# EAGLE board GNUBLIN_1_6 (EAGLE 6.4)
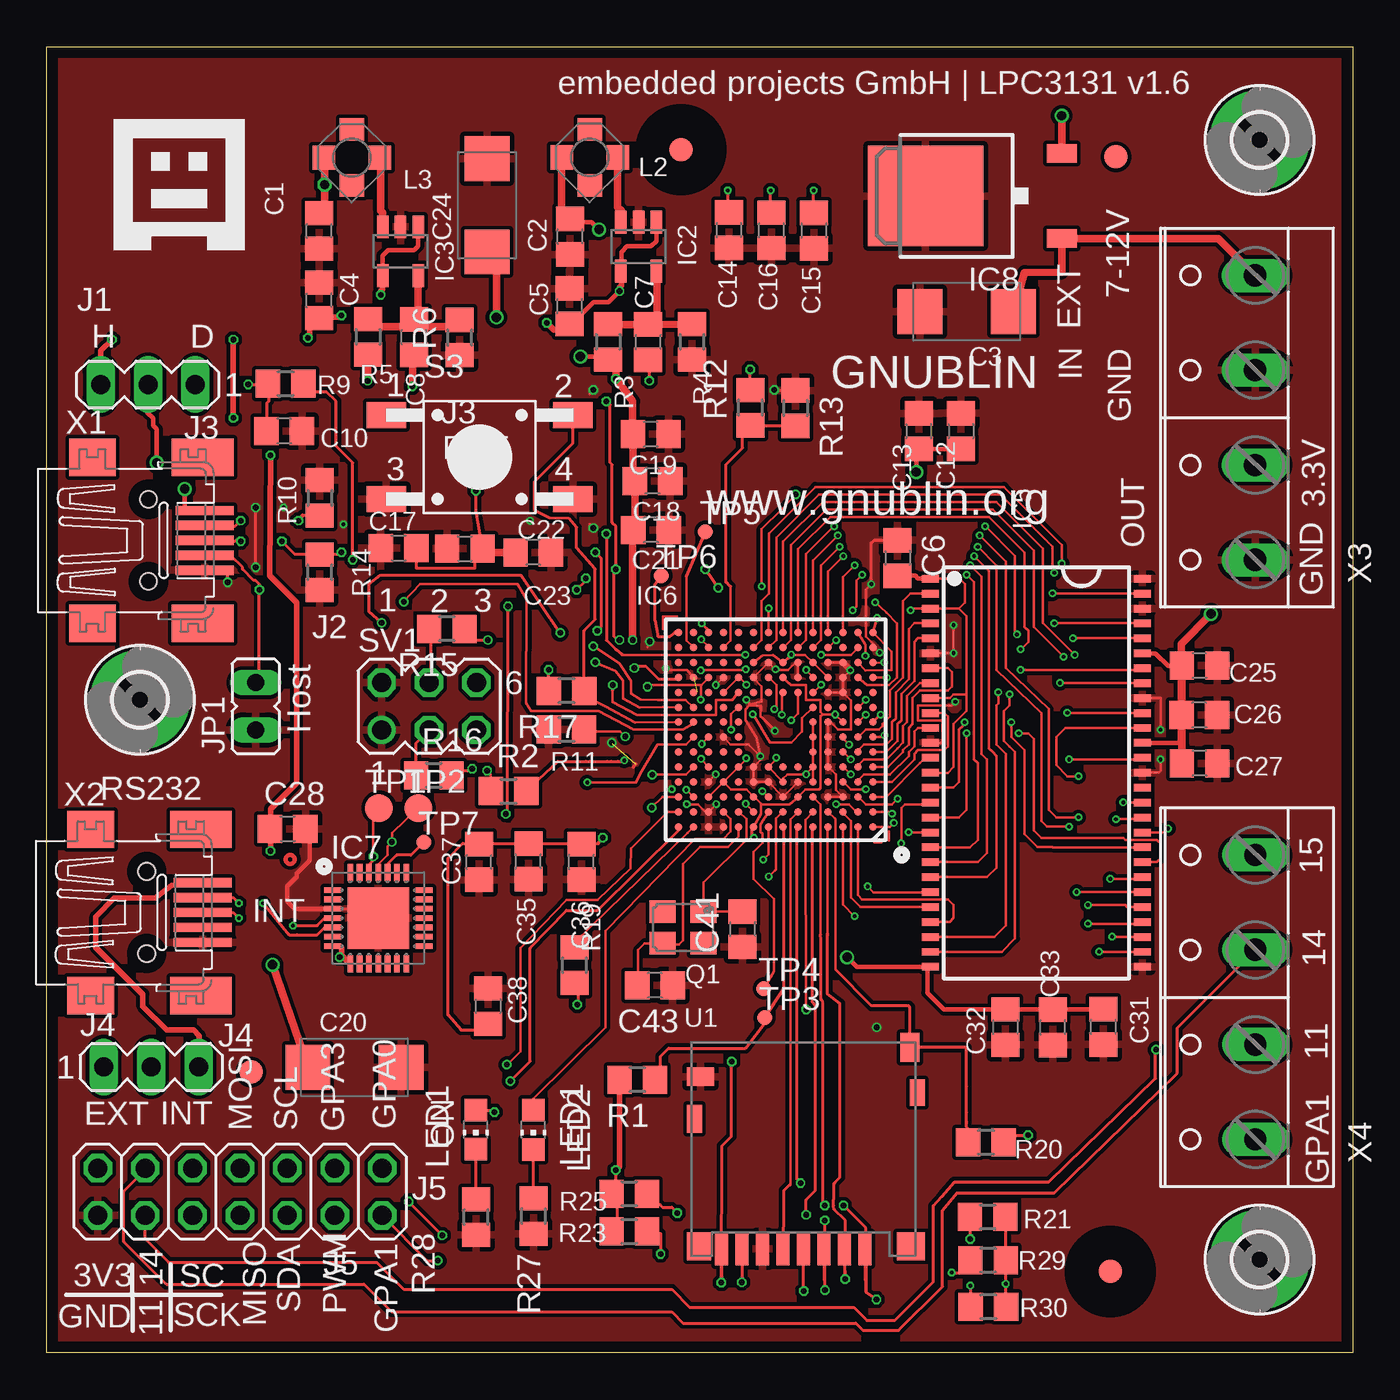
[diagram p2: board, top side]
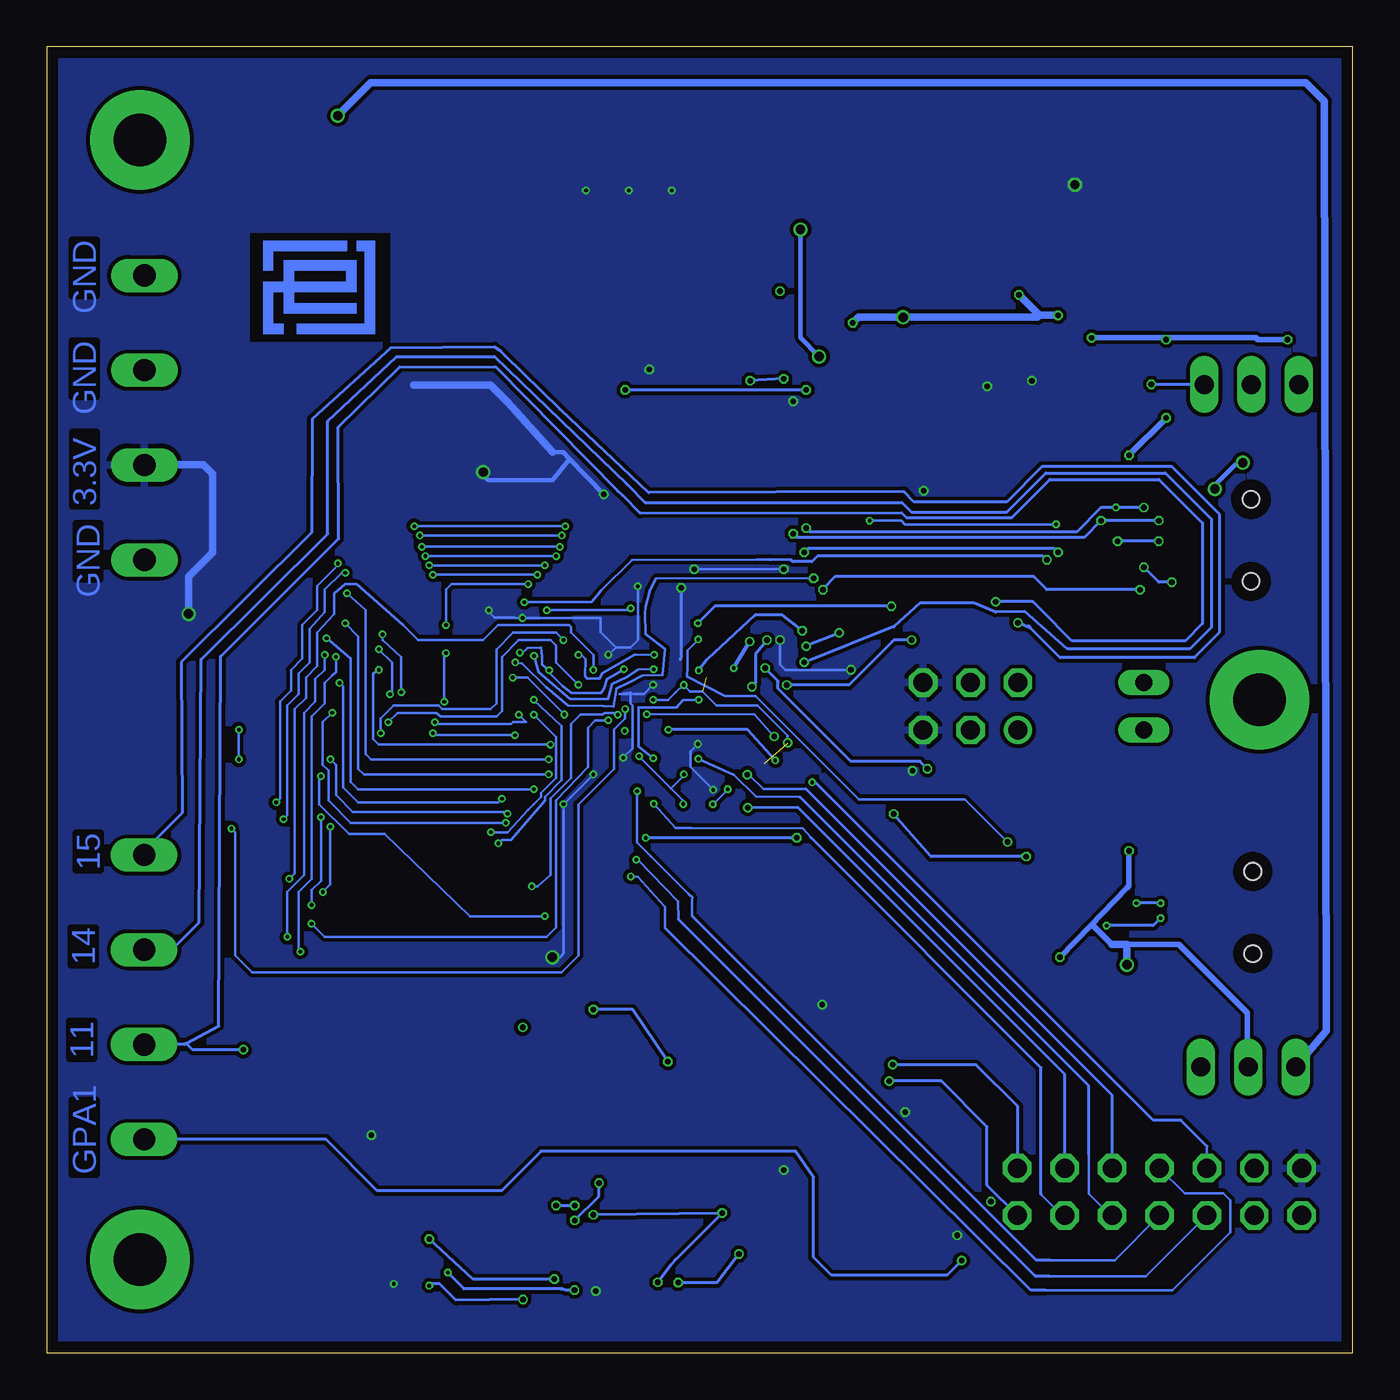
[diagram p3: board, bottom side, seen from below]

Size 70 x 70 mm. Coordinates in mm from the lower left corner, seen from the top.
Outline: 0,70 70,70 70,0 0,0 0,70
Copper layers (1*16): Top 0.035mm / dielectric 0.1mm / Bottom 0.035mm
Design rules "default *": minimum track width 0.12mm, minimum drill 0.2mm, track to track 0.025mm, track to pad 0.1mm, pad to pad 0.1mm, via to via 0.1mm, smd to smd 0mil, copper to edge 0.6mm, drill to drill 8mil, minimum pad ring 6mil, minimum via ring 4mil, stop-mask expansion 2mil, vias tented up to drill 20mil, thermal gap 10mil
Net classes: 0 default: width 0.2 mm, drill 0.3 mm, clearance 0.2 mm; 1 500mA: width 0.3 mm, drill 0.3 mm, clearance 0.15 mm
bRestrict: area 51.6,54.2 to 59.1,60

## Footprints (pad centres in the part's own frame; a part is rotated, then mirrored left to right if it is on the bottom)
C0805 = smd 1.3 x 1.5: 1 -0.95,0; 2 0.95,0
SMC_C = smd 2.4 x 2.4: + -2.5,0; - 2.5,0
PASSERMARKEN_FIDUCIAL = smd 1.27 x 1.27: 1 0,0
2,8-PAD = drill 2.8 pad 5.334: B2,8 0,0
TSOT23 = smd 0.622 x 1.22: 1 -0.95,-1.31; 2 0,-1.31; 3 0.95,-1.31; 4 0.95,1.31; 5 -0.95,1.31
TSOPII = smd 0.4 x 0.9: 1 1.03,0.67; 2 1.83,0.67; 3 2.63,0.67; 4 3.43,0.67; 5 4.23,0.67; 6 5.03,0.67; 7 5.83,0.67; 8 6.63,0.67; 9 7.43,0.67; 10 8.23,0.67; 11 9.03,0.67; 12 9.83,0.67; 13 10.63,0.67; 14 11.43,0.67; 15 12.23,0.67; 16 13.03,0.67; 17 13.83,0.67; 18 14.63,0.67; 19 15.43,0.67; 20 16.23,0.67; 21 17.03,0.67; 22 17.83,0.67; 23 18.63,0.67; 24 19.43,0.67; 25 20.23,0.67; 26 21.03,0.67; 27 21.83,0.67; 28 21.83,12.03; 29 21.03,12.03; 30 20.23,12.03; 31 19.43,12.03; 32 18.63,12.03; 33 17.83,12.03; 34 17.03,12.03; 35 16.23,12.03; 36 15.43,12.03; 37 14.63,12.03; 38 13.83,12.03; 39 13.03,12.03; 40 12.23,12.03; 41 11.43,12.03; 42 10.63,12.03; 43 9.83,12.03; 44 9.03,12.03; 45 8.23,12.03; 46 7.43,12.03; 47 6.63,12.03; 48 5.83,12.03; 49 5.03,12.03; 50 4.23,12.03; 51 3.43,12.03; 52 2.63,12.03; 53 1.83,12.03; 54 1.03,12.03
TFBGA180 = smd 0.4 x 0.4: A1 -5.2,5.2; A2 -4.4,5.2; A3 -3.6,5.2; A4 -2.8,5.2; A5 -2,5.2; A6 -1.2,5.2; A7 -0.4,5.2; A8 0.4,5.2; A9 1.2,5.2; A10 2,5.2; A11 2.8,5.2; A12 3.6,5.2; A13 4.4,5.2; A14 5.2,5.2; B1 -5.2,4.4; B2 -4.4,4.4; B3 -3.6,4.4; B4 -2.8,4.4; B5 -2,4.4; B6 -1.2,4.4; B7 -0.4,4.4; B8 0.4,4.4; B9 1.2,4.4; B10 2,4.4; B11 2.8,4.4; B12 3.6,4.4; B13 4.4,4.4; B14 5.2,4.4; C1 -5.2,3.6; C2 -4.4,3.6; C3 -3.6,3.6; C4 -2.8,3.6; C5 -2,3.6; C6 -1.2,3.6; C7 -0.4,3.6; C8 0.4,3.6; C9 1.2,3.6; C10 2,3.6; C11 2.8,3.6; C12 3.6,3.6; C13 4.4,3.6; C14 5.2,3.6; D1 -5.2,2.8; D2 -4.4,2.8; D3 -3.6,2.8; D4 -2.8,2.8; D5 -2,2.8; D6 -1.2,2.8; D7 -0.4,2.8; D8 0.4,2.8; D9 1.2,2.8; D10 2,2.8; D11 2.8,2.8; D12 3.6,2.8; D13 4.4,2.8; D14 5.2,2.8; E1 -5.2,2; E2 -4.4,2; E3 -3.6,2; E4 -2.8,2; E5 -2,2; E6 -1.2,2; E7 -0.4,2; E8 0.4,2; E9 1.2,2; E10 2,2; E11 2.8,2; E12 3.6,2; E13 4.4,2; E14 5.2,2; F1 -5.2,1.2; F2 -4.4,1.2; F3 -3.6,1.2; F4 -2.8,1.2; F5 -2,1.2; F10 2,1.2; F11 2.8,1.2; F12 3.6,1.2; F13 4.4,1.2; F14 5.2,1.2; G1 -5.2,0.4; G2 -4.4,0.4; G3 -3.6,0.4; G4 -2.8,0.4; G5 -2,0.4; G10 2,0.4; G11 2.8,0.4; G12 3.6,0.4; G13 4.4,0.4; G14 5.2,0.4; H1 -5.2,-0.4; H2 -4.4,-0.4; H3 -3.6,-0.4; H4 -2.8,-0.4; H5 -2,-0.4; H10 2,-0.4; H11 2.8,-0.4; H12 3.6,-0.4; H13 4.4,-0.4; H14 5.2,-0.4; J1 -5.2,-1.2; J2 -4.4,-1.2; J3 -3.6,-1.2; J4 -2.8,-1.2; J5 -2,-1.2; J10 2,-1.2; J11 2.8,-1.2; J12 3.6,-1.2; J13 4.4,-1.2; J14 5.2,-1.2; K1 -5.2,-2; K2 -4.4,-2; K3 -3.6,-2; K4 -2.8,-2; K5 -2,-2; K6 -1.2,-2; K7 -0.4,-2; K8 0.4,-2; K9 1.2,-2; K10 2,-2; K11 2.8,-2; K12 3.6,-2; K13 4.4,-2; K14 5.2,-2; L1 -5.2,-2.8; L2 -4.4,-2.8; L3 -3.6,-2.8; L4 -2.8,-2.8; L5 -2,-2.8; L6 -1.2,-2.8; L7 -0.4,-2.8; L8 0.4,-2.8; L9 1.2,-2.8; L10 2,-2.8; L11 2.8,-2.8; L12 3.6,-2.8; L13 4.4,-2.8; L14 5.2,-2.8; M1 -5.2,-3.6; M2 -4.4,-3.6; M3 -3.6,-3.6; M4 -2.8,-3.6; M5 -2,-3.6; M6 -1.2,-3.6; M7 -0.4,-3.6; M8 0.4,-3.6; M9 1.2,-3.6; M10 2,-3.6; M11 2.8,-3.6; M12 3.6,-3.6; M13 4.4,-3.6; M14 5.2,-3.6; N1 -5.2,-4.4; N2 -4.4,-4.4; N3 -3.6,-4.4; N4 -2.8,-4.4; N5 -2,-4.4; N6 -1.2,-4.4; N7 -0.4,-4.4; N8 0.4,-4.4; N9 1.2,-4.4; N10 2,-4.4; N11 2.8,-4.4; N12 3.6,-4.4; N13 4.4,-4.4; N14 5.2,-4.4; P1 -5.2,-5.2; P2 -4.4,-5.2; P3 -3.6,-5.2; P4 -2.8,-5.2; P5 -2,-5.2; P6 -1.2,-5.2; P7 -0.4,-5.2; P8 0.4,-5.2; P9 1.2,-5.2; P10 2,-5.2; P11 2.8,-5.2; P12 3.6,-5.2; P13 4.4,-5.2; P14 5.2,-5.2
MLP28 = smd 0.9 x 0.3: 1 -2.45,1.5; 2 -2.45,1; 3 -2.45,0.5; 4 -2.45,0; 5 -2.45,-0.5; 6 -2.45,-1; 7 -2.45,-1.5; 15 2.45,-1.5; 16 2.45,-1; 17 2.45,-0.5; 18 2.45,0; 19 2.45,0.5; 20 2.45,1; 21 2.45,1.5 | smd 0.3 x 0.9: 8 -1.5,-2.45; 9 -1,-2.45; 10 -0.5,-2.45; 11 0,-2.45; 12 0.5,-2.45; 13 1,-2.45; 14 1.5,-2.45; 22 1.5,2.45; 23 1,2.45; 24 0.5,2.45; 25 0,2.45; 26 -0.5,2.45; 27 -1,2.45; 28 -1.5,2.45 | smd 3.3 x 3.3: EXP 0,0
DPACK_3 = smd 1 x 1.6: 1 -2.28,-4.8; 3 2.28,-4.8 | smd 5.4 x 6.2: 4 0,2.5
MA03-1 = drill 1.016 long: 1 -2.54,0; 2 0,0; 3 2.54,0
2X07 = drill 1.016 octagon: 1 -7.62,-1.27; 2 -7.62,1.27; 3 -5.08,-1.27; 4 -5.08,1.27; 5 -2.54,-1.27; 6 -2.54,1.27; 7 0,-1.27; 8 0,1.27; 9 2.54,-1.27; 10 2.54,1.27; 11 5.08,-1.27; 12 5.08,1.27; 13 7.62,-1.27; 14 7.62,1.27
JP1 = drill 0.914 long: 1 0,-1.27; 2 0,1.27
PSU3014 = smd 1.2 x 1.3: 1 -1.5,0; 2 1.5,0 | smd 1.3 x 1.2: 3 0,1.5; 4 0,-1.5
CHIP-LED0805 = smd 1.2 x 1.2: A 0,-1.05; C 0,1.05
SX-32 = smd 1.4 x 1.2: 1 -1.1,-0.85; 2 1.1,-0.85; 3 1.1,0.85; 4 -1.1,0.85
R0805 = smd 1.3 x 1.5: 1 -0.95,0; 2 0.95,0
TASTER-9314_SMD = smd 2.1 x 1.4: 1 -5,2.25; 2 5,2.25; 3 -5,-2.25; 4 5,-2.25
MA03-2 = drill 1.016: 1 -2.54,-1.27 | drill 1.016 octagon: 2 -2.54,1.27; 3 0,-1.27; 4 0,1.27; 5 2.54,-1.27; 6 2.54,1.27
TP15R = smd 1.5 x 1.5: TP 0,0
TP08R = smd 0.8 x 0.8: TP 0,0
DM3D-SF = smd 0.7 x 1.75: 1 7.7,-0.875; 2 6.6,-0.875; 3 5.5,-0.875; 4 4.4,-0.875; 5 3.3,-0.875; 6 2.2,-0.875; 7 1.1,-0.875; 8 0,-0.875 | smd 1.3 x 1.5: P$1 -1.2,-0.75 | smd 1.5 x 1.5: P$10 10.15,-0.75 | smd 0.8 x 1.4: P$11 10.5,7.5 | smd 0.8 x 1.5: P$13 -1.45,6.1 | smd 1 x 1.55: SW_A 10.1,9.925 | smd 1.45 x 1: SW_B -1.125,8.35
32005-201 = smd 3.1 x 0.5: 1 3,1.6; 2 3,0.8; 3 3,0; 4 3,-0.8; 5 3,-1.6 | smd 2.5 x 2: M1 -3,-4.45; M2 -3,4.45 | smd 3.3 x 2: M3 2.9,4.45; M4 2.9,-4.45 | hole 0.9: 0,2.2; 0,-2.2
W237-4P = drill 1.194 long: 1 -7.62,-0.635; 2 -2.54,-0.635; 3 2.54,-0.635; 4 7.62,-0.635

## Placement (x,y rotation side)
C1  10uF  [C0805]  14.6,60.12 90 top
C2  10uF  [C0805]  28.05,59.81 90 top
C3  10uF  [SMC_C]  49.3,55.8 180 top
C4  4.7uF  [C0805]  14.6,56.4 90 top
C5  4.7uF  [C0805]  28.03,56.09 90 top
C6  100nF  [C0805]  45.6,42.6 270 top
C7  22pF  [C0805]  32.24,54.17 90 top
C8  22pF  [C0805]  19.69,54.43 90 top
C10  100nF  [C0805]  12.73,49.4 180 top
C12  3.3nF  [C0805]  49,49.4 270 top
C13  10uF  [C0805]  46.73,49.39 270 top
C14  10uF  [C0805]  36.58,60.16 90 top
C15  3.3nF  [C0805]  41.13,60.14 90 top
C16  100nF  [C0805]  38.85,60.15 90 top
C17  3.3nF  [C0805]  18.86,43.13 0 top
C18  100nF  [C0805]  32.47,46.72 180 top
C19  3.3nF  [C0805]  32.38,49.23 180 top
C20  [SMC_C]  16.5,15.3 0 top
C21  10uF  [C0805]  32.39,44.1 180 top
C22  100nF  [C0805]  22.41,43.09 0 top
C23  10uF  [C0805]  26.07,42.9 180 top
C24  10uF  [SMC_C]  23.6,61.5 90 top
C25  3.3nF  [C0805]  61.79,36.83 180 top
C26  100nF  [C0805]  61.78,34.19 180 top
C27  10uF  [C0805]  61.78,31.6 180 top
C28  2.2uF  [C0805]  12.92,28.08 0 top
C31  3.3nF  [C0805]  56.63,17.47 90 top
C32  10uF  [C0805]  51.39,17.46 90 top
C33  100nF  [C0805]  53.92,17.44 90 top
C35  100nF  [C0805]  25.82,26.33 90 top
C36  3.3nF  [C0805]  28.66,26.31 90 top
C37  10uF  [C0805]  23.17,26.3 90 top
C38  100nF  [C0805]  23.66,18.58 270 top
C41  22pF  [C0805]  37.3,22.7 90 top
C43  22pF  [C0805]  32.6,19.7 180 top
FID1  [PASSERMARKEN_FIDUCIAL]  34,64.48 0 top
FID2  [PASSERMARKEN_FIDUCIAL]  57,4.36 0 top
FID3  [PASSERMARKEN_FIDUCIAL]  10.95,15.05 0 top
FID4  [PASSERMARKEN_FIDUCIAL]  57.3,64.1 0 top
H1  MOUNT-PAD-ROUND2.8  [2,8-PAD]  65,5 0 top
H2  MOUNT-PAD-ROUND2.8  [2,8-PAD]  5,35 0 top
H4  MOUNT-PAD-ROUND2.8  [2,8-PAD]  65,65 0 top
IC2  AS1324  [TSOT23]  31.72,59.28 180 top
IC3  AS1324  [TSOT23]  18.96,59.03 180 top
IC5  A43E26161TSOPII  [TSOPII]  46.69,42.52 270 top
IC6  LPC313XFET180  [TFBGA180]  39.07,33.4 180 top
IC7  CP21021  [MLP28]  17.77,23.3 0 top
IC8  MC78M05ABDT  [DPACK_3]  49.6,62 90 top
J3  [MA03-1]  5.43,51.89 180 top
J4  [MA03-1]  5.6,15.32 0 top
J5  [2X07]  10.36,8.63 180 top
JP1  [JP1]  11.2,34.65 0 top
L2  4u7  [PSU3014]  29.1,64.06 180 top
L3  4u7  [PSU3014]  16.35,64.05 180 top
LED1  GRUEN  [CHIP-LED0805]  23,11.96 180 top
LED2  ROT  [CHIP-LED0805]  26.08,11.95 180 top
Q1  SX-32 12.000 MHz  [SX-32]  34.1,22.8 180 top
R1  10K  [R0805]  31.65,14.64 180 top
R2  10K  [R0805]  24.75,30.1 0 top
R3  301K  [R0805]  30.09,54.17 270 top
R4  301K  [R0805]  34.59,54.17 90 top
R5  301K  [R0805]  17.23,54.45 270 top
R6  66K5  [R0805]  22.14,54.41 90 top
R9  10K  [R0805]  12.81,51.94 0 top
R10  1M  [R0805]  14.64,45.82 270 top
R11  12K 1%  [R0805]  27.85,33.41 0 top
R12  10K  [R0805]  37.72,50.65 90 top
R13  DNP  [R0805]  40.13,50.63 270 top
R14  1M  [R0805]  14.64,41.83 90 top
R15  10K  [R0805]  21.45,38.8 180 top
R16  10K  [R0805]  20.75,30.95 0 top
R17  10K  [R0805]  27.87,35.48 180 top
R19  10K  [R0805]  28.29,20.77 90 top
R20  10K  [R0805]  50.33,11.28 180 top
R21  10K  [R0805]  50.42,7.28 180 top
R23  10K  [R0805]  31.22,6.51 0 top
R25  10K  [R0805]  31.22,8.53 0 top
R27  270R  [R0805]  26.09,7.33 90 top
R28  270R  [R0805]  23.01,7.28 90 top
R29  10K  [R0805]  50.46,4.96 180 top
R30  10K  [R0805]  50.46,2.47 180 top
S3  [TASTER-9314_SMD]  23.2,48 0 top
SV1  [MA03-2]  20.49,34.65 0 top
TP1  TPTP15R  [TP15R]  17.81,29.2 0 top
TP2  TPTP15R  [TP15R]  19.91,29.2 0 top
TP3  PTR1TP08R  [TP08R]  38.47,17.96 0 top
TP4  PTR1TP08R  [TP08R]  38.44,19.52 0 top
TP5  TPTP08R  [TP08R]  35.3,44 0 top
TP6  TPTP08R  [TP08R]  32.95,41.65 0 top
TP7  TPTP08R  [TP08R]  20.21,27.36 0 top
U1  DM3D-SF  [DM3D-SF]  36.16,6.45 0 top
U$3  GNUBLINLOGOSIEB  [GNUSIEBDRUCK]  3.6,59.1 0 top
U$4  EPLOGO  [EPLOGOKUPFER]  58.4,54.6 0 bottom
X1  MINI-USB-32005-201  [32005-201]  5.46,43.54 0 top
X2  MINI-USB-32005-201  [32005-201]  5.36,23.6 0 top
X3  [W237-4P]  64.13,50.12 90 top
X4  [W237-4P]  64.14,19.06 90 top

## Tracks (layer width: path | path; a pad name or v marks a point on that pad's centre or on a via)
5V  (via drill 0.3, 0.5)
  Top 0.254: C5.1 28.14,55.14 29.3,56.3 30.1,56.3 v30.7,56.9 | IC3.1 19.91,59.31 19.7,59.1 18.3,59.1 18,58.8 18,57.74 IC3.4 | IC2.1 32.67,59.57 32.4,59.3 31.1,59.3 30.8,59 30.8,58 IC2.4
  Top 0.3: 15.8,21.3 16.2,20.9 IC7.8 | 15.8,21.3 15.8,21.7 15.7,21.8 15.4,21.8 IC7.7 | v12,26.9 12,28 C28.1 12,28.2 12,29.15 13.4,30.55 13.4,40.2 11.95,41.65 v12,48.1 | v15.7,21.2 15.8,21.3 | v30.7,56.9 30.7,57.1 30.8,57.2 30.8,57.9 30.8,58 IC2.4 | v26.8,55.2 27.2,54.8 28,54.8 C5.1 | v17.9,56.7 17.9,56.9 18,57 18,57.7 IC3.4 | v15.8,55.6 15.7,55.5 14.7,55.5 C4.1 14.5,55.5 14.1,55.5 14.1,54.5 v14,54.4 | v3.5,54.3 2.9,53.7 J3.3 | v10,50.1 v10,54.3
  Top 0.406: v12.1,20.8 C20.+ | C24.+ 24.1,59 v24.1,55.5
  Bottom 0.3: v12,26.9 12,25.02 12.1,24.92 14.08,22.88 v15.7,21.2 | v3.5,54.3 5.1,54.3 5.2,54.4 10.2,54.4 | 10.2,54.4 v14,54.4 | 26.7,55.3 v26.8,55.2 | 16.8,55.6 16.9,55.5 | v12,48.1 v10,50.1 | v10,54.3 10.2,54.4
  Bottom 0.305: J4.2 5.65,15.37 5.65,18.21 9.33,21.89 12.91,21.89 13.9,22.88 14.08,22.88
  Bottom 0.406: v17.9,56.7 16.8,55.6 v15.8,55.6 | 26.7,55.3 26.5,55.5 v24.1,55.5 | 16.9,55.5 23.6,55.5 | 23.6,55.5 v24.1,55.5 | 12.91,21.89 12.1,21.89 v12.1,20.8 | 23.6,55.5 v24.1,55.5
+1V2  (via drill 0.2, 0.3, 0.5)
  Top 0.125: IC6.D11 IC6.C12 | IC6.D11 IC6.E10 37.48,31.8 v37.49,31.86 | IC6.D11 36.68,30.19 37.51,30.19 37.87,29.83 IC6.C9 37.92,29.8 38.3,29.42 38.28,29.36 | 38.28,29.36 38.28,28.88 IC6.A9 | 38.28,29.36 38.29,29.4 39.81,29.4 40.27,29.77 IC6.C6 40.67,30.19 41.41,30.19 41.48,30.27 41.48,34.12 41.59,34.2 | 41.59,34.2 42.09,34.2 | 42.09,34.2 v42.26,34.21 | v42.26,34.21 IC6.H3 | IC6.L1 44.92,36.2 v45.03,36.19 | 42.09,34.2 v42.26,34.21 | IC6.L7 39.53,36.2 39.47,36.16 39.67,35.99 39.9,35.79 40.7,35.79 40.7,35 41.46,35 41.46,34.35 41.59,34.2 | v35.06,35 35.06,35.75 35.09,35.79 | 35.09,35.79 35.49,36.2 IC6.L12 35.47,36.17 35.09,35.79 | 35.09,35.79 32.21,35.79
  Top 0.15: C38.2 23.6,17.3 22.2,17.3 21.5,18.1 21.5,26.5 22.3,27.3 23.1,27.3 C37.2 23.2,27.3 25.8,27.3 C35.2 25.9,27.3 28.6,27.3 C36.2 28.7,27.3 29.6,27.3 29.6,27.4 v29.8,27.6 | v37.9,27.6 37.8,27.7 37.8,28.1 IC6.A9 | 27.6,60.6 28,60.6 C2.2 | 27.6,64 L2.2 | 31.4,49.2 C19.2 31.4,49.3 31.4,49.7 | 31.4,44.1 C21.2 31.4,44 | 31.5,46.1 31.5,46.7 C18.2 | 30.5,53.2 30.1,53.2 R3.2 | v32.3,52.1 32.3,53.1 32.1,53.2 C7.1 | 32.21,35.79 v32.2,35.7 | 32.21,35.79 32.2,35.8 32.21,35.79
  Top 0.254: 28,60.6 29.2,60.6 v29.6,60.2 | v28.6,53.4 29.92,53.4 R3.2
  Top 0.406: 27.6,60.6 27.6,64 | 30.5,53.2 v30.5,52.2 31.4,51 31.4,49.7 | v31.4,38.2 31.4,44 | C21.2 31.52,44.17 C18.2 | 31.5,46.7 31.43,46.77 C19.2
  Bottom 0.125: v45.03,36.19 44.24,36.19 v42.26,34.21 | v35.06,35 35.8,34.99 35.9,34.99 36.24,34.59 38.27,34.58 38.27,32.5 v37.49,31.86
  Bottom 0.15: v29.8,27.6 v37.9,27.6 | v30.5,52.2 v32.3,52.1 | v32.2,35.7 32,35.9 32,36.1 | 32,36.1 32,36.2 32,36.1 | 32,36.1 32,37.5 v31.4,38.2
  Bottom 0.254: v29.6,60.2 29.6,54.4 v28.6,53.4
+3V3  (via drill 0.2, 0.3, 0.5)
  Top 0.125: IC6.M2 43.87,36.58 45.26,36.6 45.27,37.58 IC6.P1 v44.5,39.38 | IC6.L10 36.99,36.17 | IC6.C13 v34.28,30.17 | v37.5,35.81 37.11,36.22 IC6.L10 | IC6.G12 v35.1,32.63 | R2.1 23.8,31 v23.6,31.2 | IC6.H5 IC6.G5 IC6.F5 IC6.E5 | IC6.L4 IC6.M5 40.64,37.39 39.94,37.39 IC6.M7 | IC6.M7 v39.9,37.42 | v38.32,41.08 38.32,44.14 39.43,45.25 v40.14,46 | 60.83,32.13 60.78,36.06 60.81,36.38 C25.2 60.81,36.8 | IC6.M9 38.35,37.38 38.93,37.39 IC6.M7 | 36.28,35.4 IC6.K11 36.28,35.4 | IC6.B2 43.41,29 43,29.4 v42.3,29.4 | IC6.E5 IC6.D5 | IC6.E5 40.7,31.02 v40.7,31 39.7,31 39.47,30.77 IC6.D7 IC6.E8 39.1,31.82 v39.1,31.9 | IC5.27 47.2,20.65 | v46.3,39.8 46.39,39.89 IC5.3 47.38,39.9 48.9,39.9 | 60.75,32.69 60.83,32.6 | 49.29,35.29 49.3,34.99 | 49.29,35.29 49.3,34.99 | 49.29,35.29 48.59,35.29 48.4,35.1 IC5.9 | 49.29,35.29 49.3,35.4 49.3,39.5 48.9,39.9 | IC5.14 48.29,31.09 48.6,31.4 48.6,33.7 49.3,34.4 49.3,34.99 | 36.28,35.4 36.3,35.4 | IC5.1 48.91,41.49 49.2,41.2 49.2,40.2 48.9,39.9 | IC5.43 60.79,32.69 60.8,32.7 | IC6.L10 36.28,35.4
  Top 0.15: R30.1 51.4,2.5 v51.4,3.7 51.4,4.9 R29.1 51.4,5 51.4,7.2 R21.1 | R23.1 30.6,6.5 30.6,8.5 R25.1 30.5,8.7 v30.5,9.8 | v14.9,62.6 14.9,64.1 L3.2 14.9,64 | 14.9,61.1 14.7,61.1 C1.2 | v28.44,18.66 28.52,19.95 R19.1 | v26.9,36.6 26.9,35.5 R17.2 | v52.59,11.66 51.26,11.65 R20.1 | 17.2,53.1 R5.2 | 19.6,53.1 C8.1 | v37.7,52.7 37.7,51.6 R12.2 | v36.5,62.3 36.5,61.3 C14.2 | v38.8,62.3 38.8,61.3 C16.2 | v41.1,62.3 41.1,61.1 C15.2 | v40.58,3.32 40.57,3.56 U1.4 | v23,46.2 23,45.1 C22.2 22.95,43.09 22.95,42.05 19.81,42.05 C17.2 | v30,51 30.2,50.8 30.2,47.7 30.3,47.6 30.3,44.5 30.5,44.3 v30.5,42 30.4,41.9 30.4,38.4 30.6,38.2 v30.7,38.2 | v35.3,42 v36,41 | v24,12.9 23.9,13 23.1,13 23,13.1 LED1.A | v21.2,6.3 v19.4,8.1 | C32.2 | 53.9,18.4 C33.2 54,18.4 | 56.6,18.4 C31.2
  Top 0.254: C32.2 53.9,18.4 | 54,18.4 56.6,18.4 | C32.2 48.09,18.41 47.2,19.3 47.2,20.65 | IC5.27 43.61,20.69 43.41,20.69 v42.9,21.2 | IC5.49 59.41,37.49 60.1,36.8 60.81,36.8 | IC5.43 60.75,32.69 | C6.2 46.55,41.65 46.7,41.5 IC5.1 | v46.6,47.2 46.6,47.81 C13.2 48.89,48.44 C12.2
  Top 0.305: R1.2 30.7,10 v30.5,9.8
  Top 0.406: 14.9,61.1 14.9,64 | v17.2,52.1 17.2,53.1 | v19.6,51.8 19.6,53.1 | C22.2 23.36,42.9 C23.2 | C27.2 60.83,32.6 C26.2 60.83,36.64 60.78,36.64 60.78,36.83 C25.2 | 60.8,32.7 60.8,38 v62.4,39.6
  Bottom 0.125: v34.28,30.17 34.26,30.2 34.3,30.2 35.5,31.4 35.5,32.23 v35.1,32.63 35.1,32.58 | v39.9,37.42 39.5,37.8 | 39.5,37.8 38.7,37.8 38.3,38.2 v38.32,41.08 | v40.7,31 41.9,29.8 42.2,29.5 v42.3,29.4 42.3,21.4 42.5,21.2 v42.9,21.2 | v46.3,39.8 46.3,39.7 46,39.4 44.92,39.4 v44.5,39.38 40.33,39.39 40.33,38.63 39.5,37.8 | v39.1,31.9 38.6,32.4 38.6,34.7 38.7,34.8 38.7,35.4 39.3,35.3 38,35.3 v37.5,35.81 | v30.5,42 v35.3,42 | v26.9,36.6 30.4,36.6 30.7,36.9 v30.7,38.2
  Bottom 0.15: v36,41 36,37.3 36.05,37.15 | 42.88,48.27 42.89,48.33
  Bottom 0.254: v40.14,46 41.97,47.9 | 41.97,47.9 42.9,46.77 46.35,46.77 46.57,46.97 v46.6,47.2 | 42.88,48.27 42.34,48.27 41.97,47.9
  Bottom 0.406: 42.88,48.27 45.31,50.96 46.21,51.86 50.34,51.86 | v62.4,39.6 62.4,41.6 61.1,42.9 61.1,47.1 61.6,47.6 64.75,47.6 X3.2
  pour Bottom: -2.23,72.83 73.51,72.83 73.51,-5.33 -2.22,-5.33 -2.22,72.82
EXT_5V  (via drill 0.5)
  Top 0.406: v54.4,66.3 IC8.3
  Bottom 0.406: J4.1 1.43,17.25 1.53,67.07 2.53,68.07 52.02,68.07 52.63,68.07 v54.4,66.3
GND  (via drill 0.2, 0.3)  (2 unrouted)
  Top 0.125: IC6.D6 39.57,29.89 39.5,29.89 39.47,29.86 IC6.C7 IC6.D8 IC6.D9 IC6.E9 38.25,31.77 v38.25,31.97 | IC6.E4 | IC6.G11 36.27,32.97 36.64,32.6 37.62,32.6 v38.25,31.97 | v35.89,29.41 IC6.B12 35.3,29 34.9,29.4 v34.3,29.4 | IC6.D12 35.47,30.62 v35.85,31 | IC6.N1 v44.64,37.53 44.64,37.46 44.3,37.8 44.3,38 43.9,38.4 43.9,40.9 v44.2,41.2 | 43.07,36.6 v43.07,36.58 42.67,36.18 IC6.K3 | IC6.L13 34.31,36.59 33.4,36.59 33.26,36.7 v33.18,36.7 | v32.33,38.12 32.34,38.09 32.21,37.83 | 38.27,34.67 38.25,34.63 38.25,34.15 39.03,33.37 v39.03,33.33 38.25,34.11 38.27,34.67 | 38.27,34.67 38.07,34.69 37.65,34.69 37.45,34.47 37.45,33.92 38.05,32.99 v38.25,31.97 | IC6.L11 v35.87,35.79 v35.86,35.79 | v30.29,32.69 30.29,32.66 | v25.9,44.6 26,44.6 | IC6.C4 IC6.C3 42.3,30.17 42.3,31 41.91,31.39 IC6.E4 | IC6.E4 IC6.F4 IC6.G4 IC6.H4 42.01,33.8 42.4,33.4 43.1,33.4 43.1,34.97 IC6.K3 | IC6.K3 IC6.L3 | IC6.K3 IC6.K4 | IC6.M3 IC6.M4 | IC6.L6 IC6.M6 40.12,36.99 39.73,36.6 39.1,36.6 39.07,36.6 IC6.M8 IC6.L9 37.87,36.17 38.3,35.7 38.3,34.9 37.7,34.74 | IC5.12 47.89,32.69 48,32.8 48,33.9 46.7,33.9 46.7,34.7 48.5,34.7 v48.7,34.9 | IC5.6 47.38,37.5 v48.6,37.5 v48.6,39 | IC5.46 59.69,35.09 59.7,35.1 v59.7,33.4 | v59.7,31.8 59.7,31.2 59.6,31.1 58.74,31.1 IC5.41 | v37.5,35 37.7,34.74 | 37.7,34.74 38.27,34.67
  Top 0.15: 15.3,23.8 IC7.3 15.4,23.8 16.7,23.8 16.7,23.4 16.8,23.3 17.7,23.3 IC7.EXP | v39.06,36.63 39.1,36.6 39.07,36.6 | v39,51.6 40.1,51.6 R13.1 | v29.3,51.6 29.1,51.4 | v29.3,44.2 29.1,44.4 | v11.2,42.1 v11.2,45.3 | v9.7,41.3 9.7,41.8 9.6,41.9 8.5,41.9 | C6.1 44.35,43.55 44.2,43.4 v44.2,41.2
  Top 0.2: 31.56,31.55 31.55,31.55 31.44,31.39
  Top 0.254: IC7.3 13.3,23.8 12.9,24.2 12.9,25 13.4,25.5 13.4,25.7 14.1,26.4 14.1,27.85 C28.2
  Top 0.305: 43.07,36.6 IC6.M3
  Bottom 0.125: v35.89,29.41 35.89,29.61 36.53,30.25 | v38.25,31.97 36.53,30.25 | v35.85,31 35.85,30.93 36.53,30.25 | v44.64,37.53 44.59,37.43 44.23,37.78 43.5,37.8 43.46,37.31 43.46,36.9 v43.07,36.58 43.07,36.45 42.35,35.75 41.87,35.36 40.29,35.37 40.13,35.59 39.98,36.12 v39.06,36.63 | v30.29,32.69 30.29,33.08 31.91,34.7 32.15,34.7 34.1,34.7 34.85,35.45 35.52,35.45 v35.86,35.79 36.3,35.4 36.7,35 v37.5,35 | v34.3,29.4 v33.5,30.2 | v15.9,44.4 18.2,44.4 18.3,44.4 24,44.4 24.2,44.6 v25.9,44.6 | v48.7,34.9 48.7,37.4 v48.6,37.5 | v59.7,31.8 v59.7,33.4 | v44.2,41.2 48.3,41.2 48.6,40.9 v48.6,39
  Bottom 0.15: v29.3,51.6 v39,51.6 | v29.3,44.2 29.1,44 14.8,44 13.5,45.3 v12.7,45.3 v11.2,45.3 | v11.2,42.1 10.4,41.3 v9.7,41.3
  Bottom 0.254: v32.33,38.12 v33.18,36.7
  other vias: 44.49,17.44
  pour Top: 0.75,73.53 74.92,73.53 74.92,-6.08 -3.55,-6.08 -3.55,73.54
GPA0  (via drill 0.3)
  Top 0.125: IC6.B14 33.28,29 31.33,27.04 31.3,25.96 29.51,24.27 27.87,24.27 25.39,21.69 25.39,16.16 v24.67,15.44
  Bottom 0.15: v24.67,15.44 20.19,15.44 17.96,13.21 17.96,9.92 J5.1
GPA1  (via drill 0.3)
  Top 0.15: IC6.A14 33.87,28 29.51,23.71 27.86,23.71 25.91,21.69 25.91,15.63 v24.85,14.57 | v20.97,4.94 20.4,4.94 J5.2
  Bottom 0.15: v24.85,14.57 22.05,14.57 19.6,12.12 19.6,8.98 J5.2 | X4.1 55.03,11.44 52.28,8.69 45.62,8.69 43.51,10.8 29.87,10.8 28.9,9.41 28.9,5.12 27.94,4.16 21.75,4.16 v20.97,4.94
GPA3  (via drill 0.3)
  Top 0.125: IC6.C14 32.99,29.8 v32.42,29.22
  Bottom 0.125: 29.75,29.24 v32.42,29.22
  Bottom 0.15: 29.75,29.24 15.44,14.93 J5.3
GPIO0  (via drill 0.3)
  Top 0.125: IC6.K10 37.07,35.44 36.75,34.99 35.88,34.99 35.87,34.19 33.02,34.19 31.65,34.18 30.33,34.87 30.32,35.49
  Top 0.15: v30.34,35.79 30.32,35.49 | v23.65,38.2 22.55,38.2 R15.1
  Bottom 0.125: 24.6,38.2 24.68,38.12
  Bottom 0.15: v30.34,35.79 27,35.8 24.68,38.12 | 24.6,38.2 24.68,38.12 | 24.6,38.2 24.68,38.12 | v23.65,38.2 24.6,38.2
GPIO2  (via drill 0.3)
  Top 0.15: v31.5,36.7 31.6,36.8 32.1,36.8 32.8,36.1 33.8,36.1 IC6.L14 | v22.8,31.3 22.7,31.2 22.5,31.2 22.2,31.2 21.8,31.6 21.7,31.6 21.7,31 R16.2
  Bottom 0.15: v31.5,36.7 30.8,36 30.8,35.6 26.9,31.7 23.2,31.7 v22.8,31.3
GPIO11  (via drill 0.3)
  Top 0.125: 34.67,33.74 34.1,33.4 31.45,33.4 29.58,34.4 25.96,34.4 25.69,34.83 25.73,40.38 25.23,41.21 20.01,41.21 v19.14,40.26
  Top 0.15: 34.67,33.74 IC6.H13 | J5.12 5.28,6.11 6.54,4.85 17.69,4.85 19.14,3.4 33.5,3.4 34.46,2.44 43.25,2.44 43.95,1.74 45.45,1.74 47.51,3.8 47.51,7.88 47.98,8.38 48.65,9.16 53.7,9.16 59.42,14.7 59.42,16.2 v59.46,16.24
  Bottom 0.15: X4.2 62.62,16.52 62.52,16.58 | 62.52,16.58 60.78,17.51 60.68,37.33 54.34,43.63 54.37,49.61 51.08,52.83 45.95,52.84 39.39,46.17 39.14,45.96 38.2,45.01 24.18,45.02 23.92,44.76 18.28,44.76 16.24,46.8 10.39,46.8 8.06,44.47 8.06,39.08 8.98,38.16 15.05,38.16 16.73,39.84 17.15,40.26 v19.14,40.26 | v59.46,16.24 62.18,16.24 62.52,16.58
GPIO14  (via drill 0.3)
  Top 0.125: IC6.J14 33.01,34.6 31.76,34.59 30.89,35.06 30.88,36.03 30.48,36.55 v29.4,37
  Top 0.15: J5.11 5.28,9.8 4.13,8.65 4.13,5.96 6.41,3.68 17,3.68 18.49,2.19 33.5,2.19 34.1,1.59 43.36,1.59 43.75,1.2 45.66,1.2 48.01,3.55 48.01,7.64 48.77,8.57 54,8.57 60.59,14.99 60.59,17.41 X4.3
  Bottom 0.15: X4.3 63.31,21.6 61.83,23.08 61.72,37.16 54.94,43.88 54.94,49.93 51.24,53.4 46,53.4 38.91,46.55 38.88,46.53 37.92,45.57 24.17,45.57 23.66,45.06 18.55,45.06 16.46,47.15 10.05,47.15 7.58,44.68 7.58,38.88 8.74,37.72 15.29,37.72 17.58,39.73 19.15,39.7 20.31,40.19 23.21,40.18 24.59,38.92 v29.4,37
GPIO15  (via drill 0.3)
  Top 0.125: IC6.J13 34.24,35 32.76,35 31.82,35.01 31.31,35.34 31.31,36 30.69,36.94 v29.3,37.87
  Top 0.15: v27.52,38.58 25.42,41.67 17.9,41.67 17.29,41.19 17.27,40.96 17.28,39.72 v17.95,39.13
  Bottom 0.15: 64.78,26.91 62.74,28.94 62.78,37.01 55.81,43.95 55.77,50.05 51.58,53.85 46,53.9 45.7,53.71 45.44,53.44 42.49,50.57 42.42,50.51 37.74,46.09 24.07,46.15 23.52,45.6 18.55,45.6 16.66,47.49 9.7,47.49 7.13,44.92 7.13,38.62 8.49,37.26 15.69,37.26 17.26,38.83 | 17.26,38.83 17.4,38.97 | v27.52,38.58 v29.3,37.87 | 17.26,38.83 v17.95,39.13
  Bottom 0.305: 64.78,26.91 X4.4
I2C_SCL  (via drill 0.3)
  Top 0.125: IC6.E13 34.25,30.99 v32.45,30.99
  Bottom 0.125: v32.45,30.99 32.35,30.98 31.59,30.22 29.32,30.22
  Bottom 0.15: 29.32,30.22 12.9,13.8 J5.5
I2C_SDA  (via drill 0.2)
  Top 0.125: IC6.E12 v35.07,31.83
  Bottom 0.125: v35.07,31.83 33.17,30.98 32,29.81 29.64,29.79 | 14.16,10.63 14.16,8.52 13,7.36 J5.6
  Bottom 0.15: 29.64,29.79 14.16,14.31 14.16,10.63
LED1
  Top 0.125: IC6.B11 36.66,28.61 36.66,27.93 36.26,27.53 34.74,27.53 29.94,22.62 29.94,17.45 26.08,13.6 LED2.A
LPC_A0
  Top 0.125: IC6.B3 42.67,28.93 43.1,28.5 43.1,24.4 43.6,23.9 47.15,23.9 IC5.23
LPC_A1
  Top 0.125: IC6.A2 43.47,24.53 43.7,24.3 48.3,24.3 48.6,24 48.6,23.3 48.4,23.1 47.18,23.1 IC5.24
LPC_A2  (via drill 0.2)
  Top 0.125: IC6.N6 40.3,37.8 40.7,38.2 40.7,42.8 v42.2,44.3 | v50.3,44.3 51.9,42.7 51.9,38.6 v52,38.5 | v51,35.4 51,34.8 50.9,34.7 50.9,32.6 51.4,32.1 51.4,22.9 50.8,22.3 47.38,22.3 IC5.25
  Bottom 0.125: v50.3,44.3 v42.2,44.3 | v52,38.5 52,38.2 51,37.3 51,35.6 v51,35.4
LPC_A3  (via drill 0.2)
  Top 0.125: IC6.P6 40.27,43.07 42,44.8 50.5,44.8 52.4,42.9 52.4,38.9 52.6,38.7 52.6,38.1 v52.2,37.7 | v51.6,35.3 51.6,34.7 51.3,34.4 51.3,32.8 51.6,32.5 51.9,32.2 51.9,32.1 51.9,22.2 51.2,21.5 47.38,21.5 IC5.26
  Bottom 0.125: v52.2,37.7 51.5,37 51.5,35.4 v51.6,35.3
LPC_A4  (via drill 0.2)
  Top 0.125: IC6.N7 39.49,37.8 39.9,38.2 39.9,43.3 41.8,45.2 50.7,45.2 52.9,43 52.9,38.9 v54.5,37.3 | v56.4,21.5 IC5.29
  Bottom 0.125: v54.5,37.3 54.5,36.5 54.7,36.3 55.1,35.9 55.1,34.8 55.8,34.1 55.8,25.4 56.5,24.7 56.5,21.6 v56.4,21.5
LPC_A5  (via drill 0.2)
  Top 0.125: IC6.P7 39.47,43.47 41.6,45.6 50.9,45.6 53.4,43.1 53.4,39.1 v55.1,37.4 | v57.1,22.3 IC5.30
  Bottom 0.125: v55.1,37.4 55.1,36.6 55.6,36.1 55.6,34.9 56.2,34.3 56.2,25.6 57.1,24.7 v57.1,22.3
LPC_A6  (via drill 0.2)
  Top 0.125: IC6.K6 40.27,34.27 v39.9,33.9 | v55.8,23 58.64,23 IC5.31
  Bottom 0.125: v39.9,33.9 40.6,33.9 41,33.5 41,31.4 42.7,29.6 42.7,22.8 43.2,22.3 55.1,22.3 v55.8,23
LPC_A7  (via drill 0.2)
  Top 0.125: IC6.P5 41.07,42.47 v42.4,43.8 | v50,43.8 51.4,42.4 51.4,36.7 53.7,34.5 53.7,29.1 54.1,28.7 v55.3,28.7 | v55.8,24 57.8,24 57.9,23.9 IC5.32
  Bottom 0.125: v50,43.8 v42.4,43.8 | v55.3,28.7 55.3,25.3 55.8,24.8 v55.8,24
LPC_A8  (via drill 0.2)
  Top 0.125: IC6.N5 41.09,37.8 41.5,38.2 41.5,42.2 v42.5,43.2 | v49.9,43.2 50.9,42.2 50.9,36.6 53.3,34.3 53.3,28.5 53.6,28.2 v54.8,28.2 | v55.2,24.7 IC5.33
  Bottom 0.125: v42.5,43.2 v49.9,43.2 | v54.8,28.2 54.8,25.1 v55.2,24.7
LPC_A9  (via drill 0.2)
  Top 0.125: IC6.L5 41.07,36.23 v40.7,36.6 | v57,25.4 58.64,25.4 IC5.34
  Bottom 0.125: v40.7,36.6 40.7,37.4 41.9,38.6 41.9,38.9 42,39 45.8,39 46.6,38.2 50.1,38.2 50.9,39 53.4,41.2 54,41.2 54.6,40.7 54.6,39.9 54.6,39.6 55.5,38.6 55.5,36.8 56.1,36.2 56.1,35.1 56.7,34.5 56.7,25.7 v57,25.4
LPC_A10  (via drill 0.2)
  Top 0.125: IC5.22 44.31,24.69 v44,25 | v39.4,34.2 39.4,35.32 IC6.K7
  Bottom 0.125: v44,25 43.7,25 43,25.6 43,29.7 41.9,30.8 41.9,33.7 41.4,34.2 40.2,34.2 40.1,34.3 39.5,34.3 v39.4,34.2
LPC_A11  (via drill 0.2)
  Top 0.125: IC6.N4 41.9,37.8 v42.3,38.2 | v52.1,33.2 52.6,33.2 52.9,32.9 52.9,28 53.3,27.6 57.7,27.6 57.8,27.5 59.5,27.5 59.7,27.3 59.7,26.5 59.5,26.3 58.74,26.3 IC5.35
  Bottom 0.125: v42.3,38.2 42.7,38.6 45,38.6 45.9,37.7 45.9,34.8 46.2,34.5 48.8,34.5 49,34.7 51.4,34.7 52.1,34 v52.1,33.2
LPC_A12  (via drill 0.2)
  Top 0.125: IC6.K5 41.09,35.4 v41.5,35.8 | IC5.36 53.91,27.09 53.9,27.1 53.1,27.1 52.4,27.8 52.4,32.3 51.7,33 v51.7,33.8
  Bottom 0.125: v41.5,35.8 42.7,37 42.7,37.9 43,38.2 43.1,38.2 44.7,38.2 45.6,37.3 45.6,34.4 45.9,34.1 48.9,34.1 49.1,34.3 51.2,34.3 v51.7,33.8
LPC_A13  (via drill 0.2)
  Top 0.125: IC6.P4 41.87,41.87 v42.7,42.7 | v49.7,42.7 50.5,41.9 50.5,32.4 50.7,32.2 50.9,32 50.9,26 50.4,25.5 47.38,25.5 IC5.21
  Bottom 0.125: v49.7,42.7 v42.7,42.7
LPC_A14  (via drill 0.2)
  Top 0.125: IC6.P3 42.67,41.57 v43.3,42.2 | v49.5,42.2 50.1,41.6 50.1,32.1 50.4,31.8 50.4,26.8 49.9,26.3 47.38,26.3 IC5.20
  Bottom 0.125: v49.5,42.2 v43.3,42.2
LPC_A15
  Top 0.125: IC6.N3 42.7,37.8
LPC_CAS  (via drill 0.2)
  Top 0.125: IC6.G1 44.8,32.99 v44.9,33.1 | v49.3,33.2 49.3,29.1 48.9,28.7 47.38,28.7 IC5.17
  Bottom 0.125: v44.9,33.1 49.2,33.1 v49.3,33.2
LPC_CKE  (via drill 0.2)
  Top 0.125: IC6.L8 38.7,36.2 39.1,35.8 39.1,34.6 v39,34.5 | v60.1,28.1 59.9,27.9 58.74,27.9 IC5.37
  Bottom 0.125: v39,34.5 39,34 39.6,33.4 39.6,31.3 41.5,29.4 41.5,21.3 42.4,20.4 59,20.4 59.9,21.3 59.9,27.9 v60.1,28.1
LPC_CLK  (via drill 0.2)
  Top 0.125: IC6.N8 38.7,37.8 39.1,38.2 39.1,43.7 41.4,46 51.1,46 53.9,43.2 53.9,41.9 v54,41.8 | v57.3,28.6 58.64,28.6 IC5.38
  Bottom 0.125: v54,41.8 54.2,41.8 55.1,40.9 55.1,39.7 55.9,38.8 55.9,37 56.5,36.4 56.5,35.3 57.1,34.7 57.1,28.8 v57.3,28.6
LPC_CS  (via drill 0.2)
  Top 0.125: IC5.19 49.49,27.09 49.9,27.5 49.9,31.6 49.7,31.8 49.7,41.3 v49.3,41.7 | v43.7,41.7 43.4,41.4 43.4,40.7 43.4,40 v43.2,39.8 | IC6.P8 38.67,39.83 v38.7,39.9
  Bottom 0.125: v49.3,41.7 v43.7,41.7 | v38.7,39.9 38.8,39.8 v43.2,39.8
LPC_D0
  Top 0.125: IC6.G2 43.49,32.99 43.9,33.4 44.6,33.4 44.8,33.6 44.8,33.7 45.2,34.1 45.2,35.5 45.9,36.2 45.9,40.3 46.3,40.7 47.15,40.7 IC5.2
LPC_D1
  Top 0.125: IC6.F2 43.47,32.22 43.47,32.27 43.8,32.6 45,32.6 45.3,32.9 45.3,33.8 45.5,34 45.5,35.4 46.2,36.1 46.2,38.8 46.5,39.1 47.15,39.1 IC5.4
LPC_D2
  Top 0.125: IC6.F1 44.99,32.2 45.6,32.8 45.6,33.7 45.8,33.9 45.8,35.3 46.5,36 46.5,38.1 46.7,38.3 IC5.5
LPC_D3
  Top 0.125: IC6.E1 45.09,31.39 45.9,32.2 45.9,32.3 46.2,32.6 46.2,33.5 46.4,33.7 46.4,35.1 46.8,35.5 48.3,35.5 48.5,35.7 48.5,36.5 48.3,36.7 47.18,36.7 IC5.7
LPC_D4
  Top 0.125: IC6.E2 43.47,31.47 43.8,31.8 45,31.8 45.6,32.4 45.9,32.7 45.9,33.6 46.1,33.8 46.1,35.2 46.8,35.9 47.15,35.9 IC5.8
LPC_D5
  Top 0.125: IC5.10 47.18,34.3 48.1,34.3 48.3,34.1 48.3,32.5 48.1,32.3 46.7,32.3 46.5,32.1 46.5,31.8 45.3,30.6 IC6.D1
LPC_D6
  Top 0.125: IC6.D2 43.47,30.67 43.8,31 45.2,31 46.2,32 46.2,32.2 46.5,32.5 46.5,33.3 46.7,33.5 47.15,33.5 IC5.11
LPC_D7
  Top 0.125: IC6.C1 44.99,29.8 46.8,31.6 47.1,31.9 47.15,31.9 IC5.13
LPC_D8  (via drill 0.2)
  Top 0.125: IC6.B1 45.2,29 v45.3,28.9 | v54.8,31.8 58.44,31.8 IC5.42
  Bottom 0.125: v45.3,28.9 45.4,28.9 45.5,29 53.6,29 54.5,29.9 54.5,31.5 v54.8,31.8
LPC_D9  (via drill 0.2)
  Top 0.125: IC6.A3 42.67,24.03 v43.3,23.4 | v55.3,30.9 54.7,30.9 54.1,31.5 54.1,33 54.6,33.5 IC5.44
  Bottom 0.125: v43.3,23.4 47.3,23.4 51.9,27.8 53.8,27.8 55.4,29.4 55.4,30.8 v55.3,30.9
LPC_D10  (via drill 0.2)
  Top 0.125: IC6.A1 45.2,28.2 v45.4,28.4 | v54.7,34.3 58.51,34.3 IC5.45
  Bottom 0.125: v45.4,28.4 53.7,28.4 54.9,29.6 54.9,31.2 55.2,31.5 55.2,33.8 v54.7,34.3
LPC_D11  (via drill 0.2)
  Top 0.125: IC6.C2 43.51,29.8 43.9,29.4 45.3,29.4 v45.6,29.7 | v54.3,35.9 58.51,35.9 IC5.47
  Bottom 0.125: v54.3,35.9 54.1,35.7 54.1,30.3 53.3,29.5 53.2,29.5 45.8,29.5 v45.6,29.7
LPC_D12  (via drill 0.2)
  Top 0.125: IC6.G3 42.67,32.93 v43,32.6 | v52.2,36.6 58.44,36.6 IC5.48
  Bottom 0.125: v43,32.6 52.2,32.6 52.5,32.9 52.5,36.4 v52.2,36.6
LPC_D13  (via drill 0.2)
  Top 0.125: IC6.D3 42.7,30.59 43.1,30.2 v43.9,30.2 | v55,38.3 58.51,38.3 IC5.50
  Bottom 0.125: v55,38.3 53.7,37.2 53.7,30.6 53.3,30.2 v43.9,30.2
LPC_D14  (via drill 0.2)
  Top 0.125: IC6.E3 42.7,31.39 v43.1,31 | v54,39.1 58.51,39.1 IC5.51
  Bottom 0.125: v43.1,31 53,31 53.3,31.3 53.3,38.4 v54,39.1
LPC_D15  (via drill 0.2)
  Top 0.125: IC6.F3 42.7,32.2 v43.1,31.8 | v53.9,40.7 58.51,40.7 IC5.53
  Bottom 0.125: v43.1,31.8 52.6,31.8 52.9,32.1 52.9,39.8 v53.9,40.7
LPC_DM  (via drill 0.2, 0.3)
  Top 0.125: IC6.N2 43.47,37.77 43.1,37.4 v41.5,37.4 | 30.61,37.6 30.82,37.41 30.9,37.41 35.02,37.4 36.01,37.4 v37.45,37.4 v37.45,37.41
  Top 0.15: v13.5,44.6 13.7,44.8 13.7,44.9 14.6,44.9 R10.2 | v10.4,44.6 10.1,44.3 8.5,44.3 X1.2 | v30,43.9 30,38.2 30.51,37.68 30.82,37.41
  Bottom 0.125: v37.45,37.41 38.48,37.42 40.21,36.44 40.37,36.15 41.03,36.14 41.14,36.28 41.11,37.17 41.34,37.4 v41.5,37.4
  Bottom 0.15: v10.4,44.6 v13.5,44.6 14.4,43.7 29.8,43.7 v30,43.9
LPC_DP  (via drill 0.2, 0.3)
  Top 0.125: IC6.P2 43.86,37.99 43.89,37.93 v43.88,37.35 | v37.47,36.64 37.3,36.59 35.11,36.59 v35.06,36.57
  Top 0.15: v12.6,43.5 13.3,42.8 14.6,42.8 R14.2 14.7,42.8 15.7,42.8 v15.8,42.9 | v10.4,43.5 10.3,43.6 10.2,43.6 10.1,43.5 8.5,43.5 X1.3 | v29.4,42.9 29.7,42.6 29.7,38.9 v29.5,38.7
  Bottom 0.125: v43.88,37.35 43.63,36.5 41.95,35.03 40.19,35.04 39.91,35.04 39.71,35.85 38.91,36.23 38.32,36.61 v37.47,36.64
  Bottom 0.15: v10.4,43.5 v12.6,43.5 | v15.8,42.9 16,43.1 29.2,43.1 v29.4,42.9 | v29.5,38.7 30.58,39.53 32.03,39.53 34.61,37.16 v35.06,36.57
LPC_DQM0  (via drill 0.2)
  Top 0.125: IC6.H1 44.27,33.83 v44.7,34.2 | v49.2,33.8 49.1,33.6 48.9,33.4 48.9,30.6 48.6,30.3 47.38,30.3 IC5.15
  Bottom 0.125: v44.7,34.2 44.3,33.8 45,33.8 45.1,33.7 49.1,33.7 v49.2,33.8
LPC_DQM1  (via drill 0.2)
  Top 0.125: IC6.N9 37.9,37.8 38.3,38.2 38.3,40.3 38.7,40.7 38.7,43.9 41.2,46.4 51.3,46.4 54.4,43.3 v54.4,42.3 | v57.7,29.5 IC5.39
  Bottom 0.125: v54.4,42.3 54.4,42.2 55.5,41.1 55.5,39.8 56.3,39 56.3,37.2 56.9,36.6 56.9,35.5 57.5,34.9 57.5,29.7 v57.7,29.5
LPC_MCI_CD
  Top 0.125: IC6.B4 42.24,28.63 42.27,28.6 42.27,26.45 42.27,20.54 42.3,20.51
  Top 0.15: 49.3,12.3 49.3,12.1 49.4,12 49.34,11.65 R20.2 | 49.3,12.3 49.3,12.4 | 49.3,12.4 49.3,12.9 | 49.3,12.4 49.3,14.3 | 49.3,12.3 49.3,16.38 U1.SW_A 46.26,18.54 46.2,18.6 44.21,18.6 42.3,20.51
LPC_MCI_CLK
  Top 0.125: IC6.B6 39.86,28.57 39.85,9.01
  Top 0.15: U1.5 39.5,7.13 39.5,8.7 39.8,9 39.85,9.01
LPC_MCI_CMD  (via drill 0.2, 0.3)
  Top 0.125: 40.34,9.2 40.34,9.17
  Top 0.15: v48.5,4.3 49.4,4.3 49.5,4.4 49.5,4.9 R29.2 | U1.3 41.7,3.3 v41.71,3.36 v41.7,7.1 | 40.34,9.2 40.4,9.2 v40.4,9.1 40.3,9.2 40.2,9.3 40.2,28.1 IC6.A6
  Bottom 0.15: v48.5,4.3 47.64,3.43 42.44,3.43 42.38,3.43 42.2,3.36 v41.71,3.36 | v41.7,7.1 40.4,8.4 v40.4,9.1
LPC_MCI_DAT0  (via drill 0.3)
  Top 0.15: v33.8,7.5 33.5,7.8 33,7.8 32.9,7.9 32.3,8.4 R25.2 | v37.25,3.78 37.23,3.93 37.3,4 37.3,4.03 U1.7 | 41.2,8.7 41.19,8.7 | 41.2,8.7 41.2,18.6 41.05,18.78 41.05,28.08 IC6.A5 | 41.2,8.7 40.7,8.2 v40.7,7.4
  Bottom 0.15: 33.95,7.35 36.3,5 36.54,4.73 v37.25,3.78 | v33.8,7.5 33.95,7.35 | v40.7,7.4 33.8,7.47 33.95,7.35
LPC_MCI_DAT1  (via drill 0.3)
  Top 0.125: IC6.B5 40.66,28.55 v40.7,18.4
  Top 0.15: v32.9,5.3 32.9,6.4 R23.2 | U1.8 36.18,3.89 v36.16,3.76 36.2,11.1 36.7,11.6 v36.71,15.6 | v40.7,18.4 40.75,18.4
  Bottom 0.15: v32.9,5.3 34.07,3.76 v36.16,3.76 | v36.71,15.6 38.6,18.4 v40.7,18.4
LPC_MCI_DAT2  (via drill 0.2, 0.3)
  Top 0.125: IC6.C5 41.47,29.4 41.47,22.41
  Top 0.15: v49.5,3.6 49.5,2.5 R30.2 | v44.47,2.86 44.37,2.96 43.92,3.24 | 43.92,3.24 43.9,3.3 U1.1 43.92,3.24 | 43.92,3.24 43.9,6.7 v42.7,7.9 | 41.7,8 v41.7,7.9 41.7,8 | 41.7,8 41.7,8.01 | 41.7,8 41.6,8.1 41.6,8.8 41.6,8.87 41.6,18.77 41.49,18.93 41.49,22.13 41.48,22.42 41.47,22.41
  Bottom 0.15: v49.5,3.6 49.4,3.7 48.94,3.7 48.07,2.83 v44.47,2.86 | v42.7,7.9 v41.7,7.9
LPC_MCI_DAT3  (via drill 0.3)
  Top 0.125: IC6.A4 41.85,28.09 41.85,22.47
  Top 0.15: v49.5,6.1 49.5,7.2 R21.2 | U1.2 42.8,4.02 v42.79,3.95 42.8,7.1 42.2,7.7 42.17,7.88 42.18,8.54 42.18,9.07 42.27,9.16 42.51,9.4 42.51,18.74 41.85,19.23 41.85,22.38 41.85,22.47
  Bottom 0.15: v49.5,6.1 47.14,3.95 v42.79,3.95
LPC_RAS  (via drill 0.2)
  Top 0.125: IC6.H2 43.47,33.77 v43.9,34.2 | v46.2,27.9 47.15,27.9 IC5.18
  Bottom 0.125: v43.9,34.2 42.7,33 42.7,30.8 43.5,30 43.5,29.8 43.9,29.4 44.2,29.1 45.3,27.9 v46.2,27.9
LPC_RXD  (via drill 0.2, 0.3)
  Top 0.125: TP1.TP 17.5,29.22 v17.5,26.6
  Top 0.15: v35.1,39.1 35.4,38.8 35.4,38.6 IC6.P12 | v24.73,40.01 24.7,28.7 v24.61,28.88 | v17.5,26.6 17.5,26.4 17.3,26.2 17.3,25.8 IC7.26
  Bottom 0.15: v24.73,40.01 25.22,40.03 34.17,40.03 v35.1,39.1 | v24.61,28.88 22.6,26.6 v17.5,26.6
LPC_TXD  (via drill 0.2, 0.3)
  Top 0.125: IC6.N12 35.47,37.84 v35.08,38.23 | IC7.25 17.77,26.18 18.27,26.68 18.27,27.14 v18.51,27.38 18.51,27.85 TP2.TP
  Bottom 0.125: v35.08,38.23 35.66,37.65 35.66,36.73 35.67,36.24 33.65,35.19 32.02,35.21 26.46,29.65 20.78,29.65 v18.51,27.38
LPC_VBUS  (via drill 0.3)
  Top 0.15: C10.2 11.8,49.4 11.8,50.9 11.9,51 11.9,51.9 R9.1 11.8,51.9 v10.8,51.9
  Bottom 0.15: v10.8,51.9 8,51.9 J3.1
LPC_WE  (via drill 0.2)
  Top 0.125: IC6.J2 43.47,34.57 v43.9,35 | v45.8,27.3 45.8,29.2 46,29.4 47.08,29.4 IC5.16
  Bottom 0.125: v43.9,35 42.4,33.6 42.4,30.7 43.3,29.8 43.3,29.6 45.1,27.5 45.6,27.5 v45.8,27.3
N$3
  Top 0.15: LED2.C 26.1,10.9 26.1,8.4 26.2,8.3 26.1,8.2 R27.2
N$4  (via drill 0.2)
  Top 0.15: v13.2,22.9 14.5,22.9 14.9,23.3 15.3,23.3 IC7.4 | v10.3,23.3 10,23.6 8.4,23.6 X2.3
  Bottom 0.15: v13.2,22.9 10.7,22.9 v10.3,23.3
N$5  (via drill 0.2)
  Top 0.15: v11.6,24.1 13,22.4 13.4,22.4 14.5,22.4 14.9,22.8 15.3,22.8 IC7.5 | v10.3,24.1 10,24.4 8.4,24.4 X2.2
  Bottom 0.15: v10.3,24.1 v11.6,24.1
N$6
  Top 0.125: 33.77,39.45 33.04,39.45 33.04,38.8
N$7
  Top 0.15: LED1.C 23,8.3 R28.2
N$8
  Top 0.15: 30.8,61.2 30.8,60.6 IC2.3 | 30.6,64 L2.1
  Top 0.406: 30.8,61.2 30.6,61.4 30.6,64
N$9
  Top 0.125: IC6.N11 36.66,38.18 36.66,41.08
  Top 0.15: R13.2 40.1,49.7 37.8,49.7 R12.1 37.7,49.7 37.3,49.7 37.3,48.5 36.4,47.6 36.4,41.3 36.6,41.1 36.66,41.08
N$10  (via drill 0.5)
  Top 0.15: 7.4,45.2 7.5,45.1 8.4,45.1 X1.1 | 5.4,51.8 J3.2
  Top 0.254: 5.4,51.8 5.4,50.4 5.7,50.1 5.7,49.7 5.9,49.5 v5.9,47.7 | 7.4,45.2 v7.4,46.3
  Bottom 0.15: 6,47.6 v5.9,47.7 | v7.4,46.3 7.4,46.5
  Bottom 0.254: 6,47.6 6.3,47.6 7.4,46.5
N$11
  Top 0.125: 44.37,27.34 44.74,27.34
N$12
  Top 0.125: 45.14,27.46 45.14,27.95
N$17
  Top 0.305: J4.3 8.18,15.36 8.18,17 7.88,17.3 6.43,17.3 5.16,18.57 5.16,19.21 2.63,21.74 2.63,23.37 3.63,24.37 5.83,24.37 6.69,25.06 X2.1
N$18
  Top 0.15: IC6.A7 39.5,28.2 39.5,20.31 39.5,19.53 TP3.TP 38.44,17.69 38.54,17.76 37.44,16.33 33.33,16.33 32.9,15.9 32.9,14.94 R1.1 33.05,14.64
N$19
  Top 0.125: IC6.B8 38.26,28.31 38.26,27.92 38.37,27.84 38.37,27.33 37.88,26.84 37.88,26.13 37.88,25.41 38.97,24.32 38.97,20.45 TP4.TP
N$23
  Top 0.15: IC7.24 18.27,26.19 18.76,26.68 19.53,26.68 TP7.TP
N$26  (via drill 0.2)
  Top 0.125: IC6.J10 37.05,34.59 36.68,34.25 v36.68,33.4
  Top 0.15: v30.95,31.75 30.9,31.7 30.6,31.7 30.25,31.7 30.05,31.7 29.1,31.7 28.9,31.7 27.4,31.7 R2.2
  Bottom 0.15: v36.68,33.4 32.45,33.4 v30.95,31.75
N$27
  Top 0.125: 20.6,38 20.6,38.2 R15.2
  Top 0.15: 20.6,38 20.6,36.03 SV1.4
  Bottom 0.125: SV1.4 20.5,36
  Bottom 0.15: SV1.4 20.5,36
N$28
  Top 0.15: R16.1 19.8,31 19.8,32.69 SV1.3
N$29
  Top 0.125: 34.67,37.83 34.28,38.18 34.28,41.59
  Top 0.15: IC6.N13 34.67,37.83 | 34.28,41.59 TP5.TP
N$30
  Top 0.15: 33.7,38.59 33.4,38.4 32.75,38.4 32.6,39.25 32.6,41.2 TP6.TP
  Top 0.254: 33.7,38.59 IC6.P14
N$38
  Top 0.15: R3.1 30.1,55.1 | 32.7,55.1 32.3,55.1 R4.2 32.7,55.1 | 32.7,57.9 IC2.5 | 32.7,55.1 34.6,55.1 C7.2
  Top 0.406: 30.1,55.1 32.2,55.1 R4.2 | 32.7,55.1 32.7,57.9
N$44
  Top 0.125: IC6.A13 34.34,27.86 28.3,22 arc90 28.29,21.99 R19.2
N$54  (via drill 0.2, 0.3)
  Top 0.125: v37.84,34.23 38.77,32.72 39.91,32.72 40.49,33.29 40.49,34.01 IC6.J5 | v31.01,33.03 30.73,33.31 30.52,33.31 28.82,33.3 R11.2
  Bottom 0.125: v37.84,34.23 32.08,34.22 v31.01,33.03
N$57  (via drill 0.2, 0.3)
  Top 0.125: IC6.L2 43.48,36.2 43.95,35.79 45.13,35.78 45.57,36.2 45.57,37.97 45.57,39.09 45,39.66 v44.4,40.23
  Top 0.15: v16.4,42.5 16.4,47.7 15.5,48.6 15.5,51 15,51.5 13.9,51.5 13.8,51.6 13.8,51.9 R9.2
  Bottom 0.125: v44.4,40.23 40.81,40.23 40.49,40.61 40.28,40.86 38.63,42.49 31.96,42.51 31.21,42.51 30.29,42.52
  Bottom 0.15: v16.4,42.5 16.6,42.7 28.7,42.7 29,42.4 30,42.4 30.1,42.5 31.21,42.51
N$67
  Top 0.15: IC3.3 18,60.4 | 17.9,64 L3.1
  Top 0.406: 18,60.4 18,61.1 17.9,61.2 17.9,64
N$81
  Top 0.406: X3.4 62.78,59.72 IC8.1 54.4,57.92 52.4,57.9 C3.+
N$132
  Top 0.15: 19.9,55.1 19.6,55.1 | 19.9,55 19.9,55.1 | 19.9,55 19.9,55.1 | 19.9,55 19.9,55.6 | 19.9,57.7 IC3.5 | R5.1 17.1,55
  Top 0.406: 19.9,57.7 19.9,55.6 19.9,55.58 C8.2 | 17.1,55 19.9,55 22,55 21.7,55.66 R6.2
PWM_DATA  (via drill 0.2)
  Top 0.125: IC6.B9 v37.46,29.42
  Bottom 0.125: v37.46,29.42 36.3,28.12 35.48,28.12 29.48,28.09 29.05,27.62 | 16.71,8.5 15.4,7.19 J5.4
  Bottom 0.15: 29.05,27.62 16.71,15.28 16.71,8.5
RESET
  Top 0.125: IC6.H14 31.52,33.78 29.95,34.65 28.81,35.24 29.03,35.53 R17.1
  Top 0.15: R17.1 28.8,35.5 28.8,38.7 29.4,39.3 29.4,42 28.41,43.13 28.41,44.24 28,44.7 26.95,44.75 26.15,45.15 26.15,46.4 26.15,46.7 28.2,48.75 S3.2
SPI_MISO  (via drill 0.2)
  Top 0.125: IC6.C8 v38.36,30.1
  Bottom 0.125: v38.36,30.1 38.36,27.92 38.36,27.36 37.61,26.61 35.6,24.6 35.4,24.4 35.41,24.29 35.41,23.42 | 16.21,4.97 12.75,4.97 J5.8
  Bottom 0.15: 35.41,23.42 16.96,4.97 16.21,4.97
SPI_MOSI  (via drill 0.2)
  Top 0.125: IC6.B7 39.45,29 39.08,28.63 39.08,26.33 39.08,25.91 v38.7,25.53 39.03,25.86
  Bottom 0.125: v38.7,25.53 38.31,25.5 37.63,24.76 36.86,23.9 36.85,22.76 | 16.5,3.36 9.68,3.36 6.57,6.47 6.57,8.18 6.93,8.54 9,8.54 J5.7
  Bottom 0.15: 36.85,22.76 17.25,3.36 16.5,3.36
SPI_SCK  (via drill 0.2)
  Top 0.125: IC6.A8 38.67,26.7 v38.4,26.43
  Bottom 0.125: v38.4,26.43 38.32,26.41 36.17,24.2 36.15,23.23 | 16.26,4.09 11.09,4.09 J5.10
  Bottom 0.15: 36.15,23.23 17.01,4.09 16.26,4.09
SYSCLOCK_O  (via drill 0.2)
  Top 0.125: IC6.G13 34.26,32.59 32.73,32.59 31.79,31.03 31.58,30.57 v28.97,30.57
  Bottom 0.125: 28.94,30.73 v28.97,30.57 | J5.9 7.82,11.07
  Bottom 0.15: 28.94,30.73 28.94,30.71 10.69,12.46 9.21,12.46 7.82,11.07
USB_ID  (via drill 0.2, 0.3)
  Top 0.125: IC6.M1 44.27,36.97 44.74,36.99 44.92,37 v44.88,37
  Top 0.15: v28.4,40.9 28.9,41.4 v28.9,41.5 | X1.4 8.5,42.7 9.9,42.7 10.5,42.1 10.5,42 11.1,41.4 11.2,41.4 11.4,41.2 v11.4,40.9 11.4,35.72 JP1.2
  Bottom 0.125: v44.88,37 44.52,36.95 43.25,35.68 42.07,34.69 40.16,34.66 39.63,34.65 39.45,35.61 38.79,35.92 38.08,36.31 37,36.33 36.87,37.72 37.9,38.51 37.92,39.64 37.9,39.98 37.67,40.88 37.34,41.5 29.05,41.51 29.03,41.53
  Bottom 0.15: v11.4,40.9 16.4,40.9 17.09,41.59 27.76,41.59 28.38,40.97 v28.4,40.9 | v28.9,41.5 29,41.5 29.03,41.53
XTAL1
  Top 0.125: IC6.A10 37.07,27.67 36.5,27.1 35,27.1 34.1,26.2 34.1,22.1 33.9,21.9 33.05,21.9 Q1.3 32.05,21.95 31.7,21.6 31.7,19.75 C43.2
XTAL2
  Top 0.125: IC6.B10 37.1,29 37.5,28.6 37.5,27.5 35.2,25.2 Q1.1 C41.2
(copper drawn outside any net)
  shapes: Top circle x1

## Text on the board
Bottom: GND | GND | 3.3V | GND | 15 | 14 | 11 | GPA1
tPlace: embedded projects GmbH | LPC3131 v1.6 | 7-12V | EXT | J1 | H | D | IN | GND | GNUBLIN | J3 | 3.3V | RST | OUT | www.gnublin.org | GND | 1 | 2 | 3 | J2 | Host | RS232 | 15 | INT | 14 | 11 | J4 | INT | GPA1 | EXT | MOSI | SCL | GPA3 | GPA0 | ON | LED1 | J5 | GPA1 | 3V3 | SC | 14 | GND | SCK | SDA | PWM | 11 | MISO
tStop: 7